# EAGLE schematic afridev_sensor (EAGLE 9.6.2)
Rev. 2 with MAX32660 microcontroller
AUTHOR: Juan Luna; BOARD_NAME: Afridev Hand Pump Sensor; COURSE: ENGR 460; DOC_NUM: 1; PROJECT_NAME: Working Well Senior Project; REVISION: 2
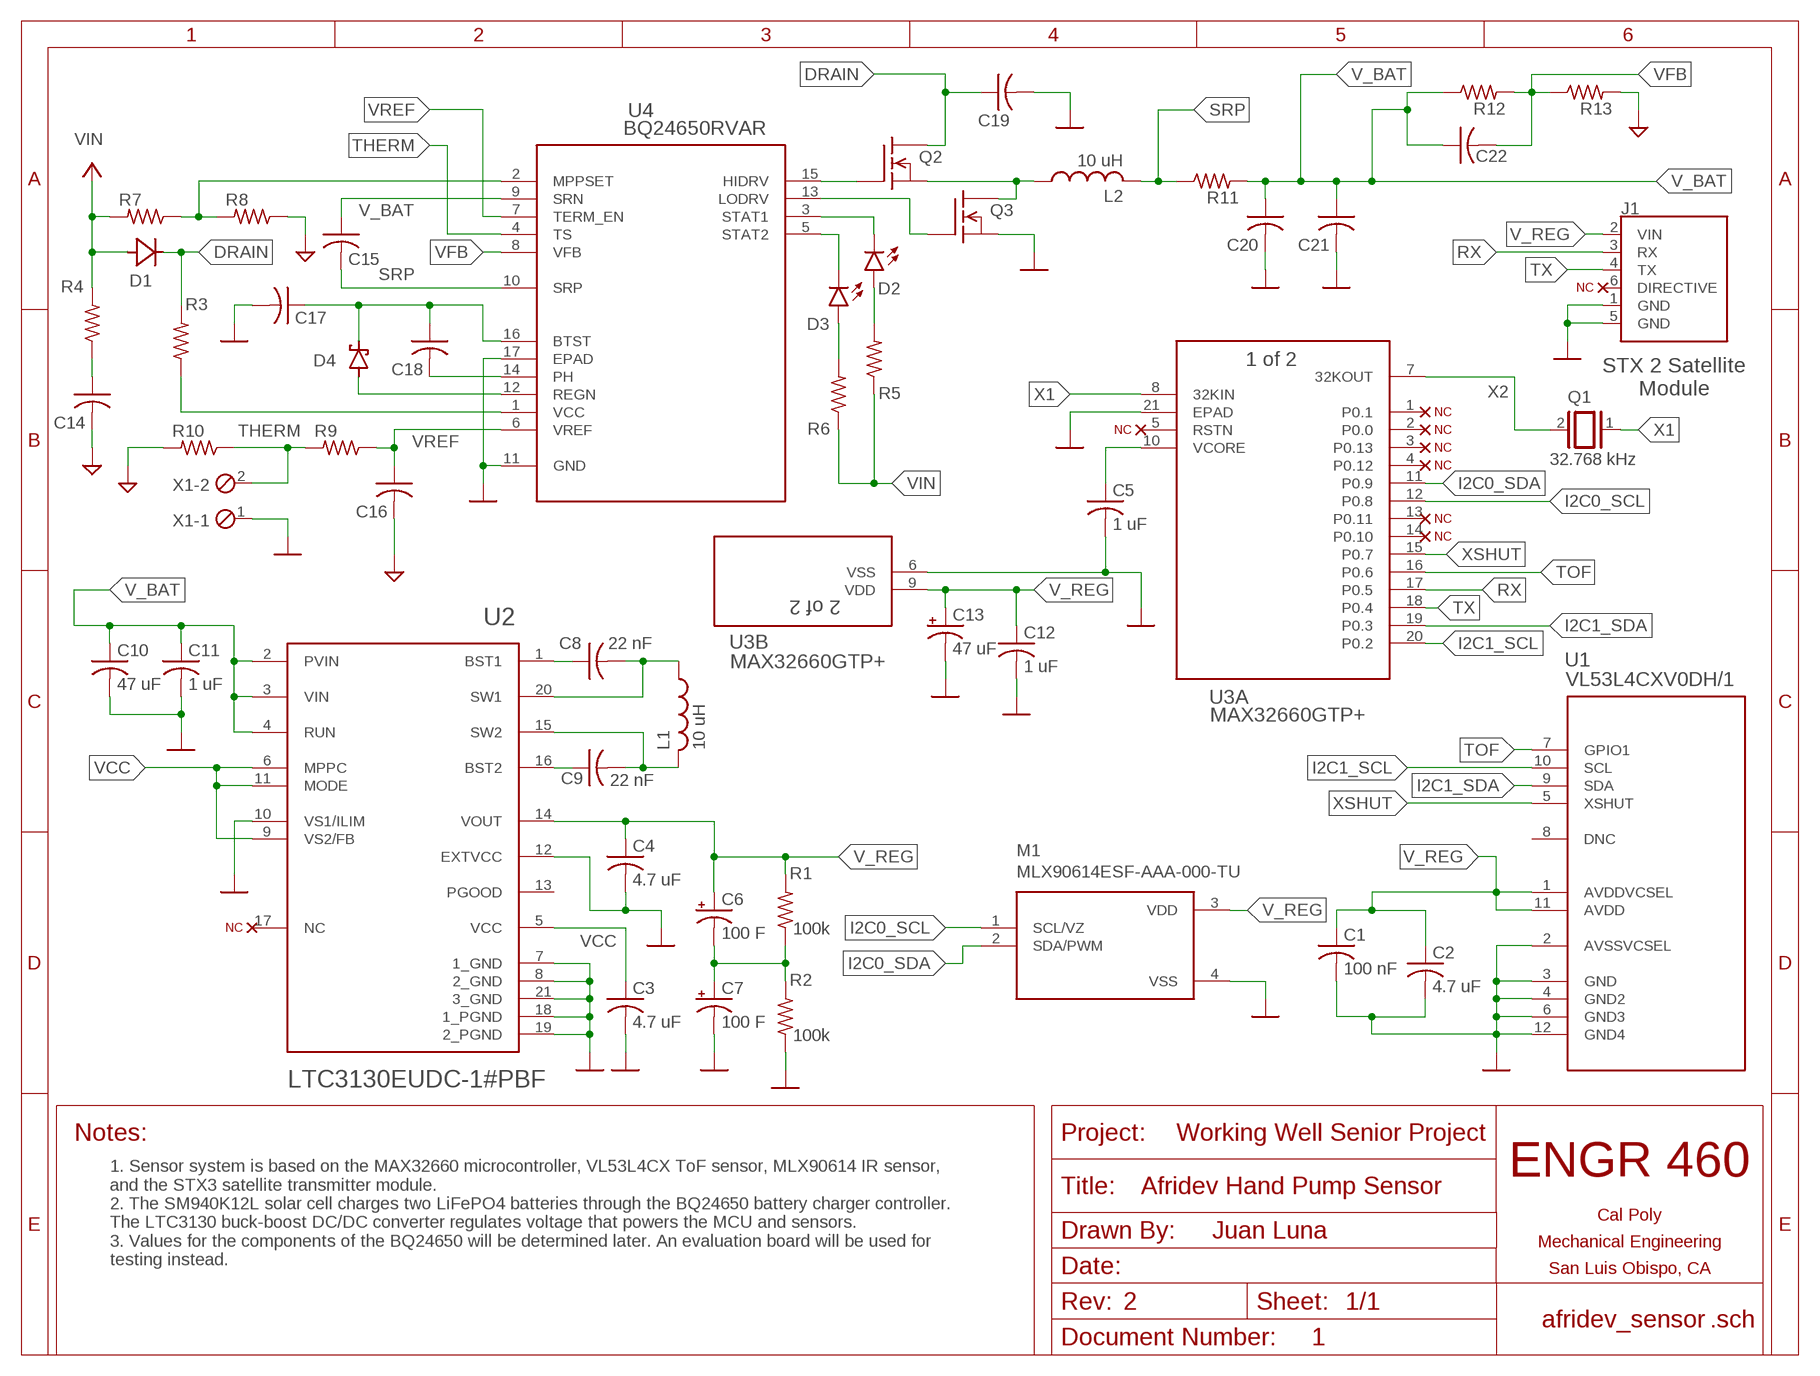
[diagram p0: schematic, sheet 1]

## Parts
C1  100 nF  C-US025-024X044  [C025-024X044]
C2  4.7 uF  C-US025-024X044  [C025-024X044]
C3  4.7 uF  C-US025-024X044  [C025-024X044]
C4  4.7 uF  C-US025-024X044  [C025-024X044]
C5  1 uF  C-US025-024X044  [C025-024X044]
C6  100 F  1000UF-RADIAL-5MM-25V-20%  [CPOL-RADIAL-5MM-10MM]
C7  100 F  1000UF-RADIAL-5MM-25V-20%  [CPOL-RADIAL-5MM-10MM]
C8  22 nF  C-US025-024X044  [C025-024X044]
C9  22 nF  C-US025-024X044  [C025-024X044]
C10  47 uF  C-US025-024X044  [C025-024X044]
C11  1 uF  C-US025-024X044  [C025-024X044]
C12  1 uF  C-US025-024X044  [C025-024X044]
C13  47 uF  1000UF-RADIAL-5MM-25V-20%  [CPOL-RADIAL-5MM-10MM]
C14  C-US025-024X044  [C025-024X044]
C15  C-US025-024X044  [C025-024X044]
C16  C-US025-024X044  [C025-024X044]
C17  C-US025-024X044  [C025-024X044]
C18  C-US025-024X044  [C025-024X044]
C19  1 uF  C-US025-024X044  [C025-024X044]
C20  1 uF  C-US025-024X044  [C025-024X044]
C21  1 uF  C-US025-024X044  [C025-024X044]
C22  1 uF  C-US025-024X044  [C025-024X044]
D1  DIODE  [DIODE-FOOT]
D2  LED  [LED-FOOT]
D3  LED  [LED-FOOT]
D4  BAS40  [SOT23]
J1  EM-506-VERTICAL  [JST-6PIN-1MM]
L1  10 uH  L-US0204/5  [0204/5]
L2  10 uH  L-US0204/5  [0204/5]
M1  MLX90614ESF-AAA-000-TU  [TO254P942H425-4]
Q1  32.768 kHz  XTAL/S  [QS]
Q2  BUZ10  [TO220]
Q3  BUZ10  [TO220]
R1  100k  R-US_R0805  [R0805]
R2  100k  R-US_R0805  [R0805]
R3  R-US_R0805  [R0805]
R4  R-US_R0805  [R0805]
R5  R-US_R0805  [R0805]
R6  R-US_R0805  [R0805]
R7  R-US_R0805  [R0805]
R8  R-US_R0805  [R0805]
R9  R-US_R0805  [R0805]
R10  R-US_R0805  [R0805]
R11  R-US_R0805  [R0805]
R12  R-US_R0805  [R0805]
R13  R-US_R0805  [R0805]
U1  VL53L4CXV0DH/1  [LGA12_STM]
U2  ANALOG_DEVICES_LTC3130EUDC-1#PBFANALOG_DEVICES_LTC3130EUDC-1#PBF_0_0  [ANALOG_DEVICES_LTC3130EUDC-1#PBF_0]
U3  MAX32660GTP+  [21-0139V_T2044+5_MXM]
U4  BQ24650RVAR  [RVA16_2P14X2P14]
U$1  NC  (no package)
U$2  NC  (no package)
U$3  NC  (no package)
U$4  NC  (no package)
U$5  NC  (no package)
U$6  NC  (no package)
U$7  NC  (no package)
U$8  NC  (no package)
U$9  NC  (no package)
X1  SCREWTERM_2P_254  [2POL254]

## Nets
AGND: C14.2 C16.2 R8.1 R10.2 R13.2
DGND: C1.2 C2.2 C3.2 C4.2 C5.2 C7.- C10.2 C11.2 C12.2 C13.- C17.2 C19.2 C20.2 C21.2 J1.1(GND) J1.5(GND) M1.4(VSS) Q3.3(S) R2.1 U1.2(AVSSVCSEL) U1.3(GND) U1.4(GND2) U1.6(GND3) U1.12(GND4) U2.7(1_GND) U2.8(2_GND) U2.10(VS1/ILIM) U2.12(EXTVCC) U2.18(1_PGND) U2.19(2_PGND) U2.21(3_GND) U3.6(B:VSS) U3.21(A:EPAD) U4.11(GND) U4.17(EPAD) X1.1
DRAIN: C19.1 D1.C Q2.2(D) R3.2
I2C0_SCL: M1.1(SCL/VZ) U3.12(A:P0.8)
I2C0_SDA: M1.2(SDA/PWM) U3.11(A:P0.9)
I2C1_SCL: U1.10(SCL) U3.20(A:P0.2)
I2C1_SDA: U1.9(SDA) U3.19(A:P0.3)
N$2: C5.1 U3.10(A:VCORE)
N$3: J1.6(DIRECTIVE) U$1.D
N$4: L2.1 Q2.3(S) Q3.2(D)
N$5: R3.1 U4.1(VCC)
N$6: C14.1 R4.1
N$7: U2.17(NC) U$2.D
N$8: C6.- C7.+ R1.1 R2.2
N$9: U3.5(A:RSTN) U$3.D
N$10: C8.1 U2.1(BST1)
N$11: C9.1 U2.16(BST2)
N$12: C8.2 L1.1 U2.20(SW1)
N$13: C9.2 L1.2 U2.15(SW2)
N$14: U3.1(A:P0.1) U$4.D
N$15: U3.2(A:P0.0) U$5.D
N$16: U3.3(A:P0.13) U$6.D
N$17: U3.4(A:P0.12) U$7.D
N$18: U3.13(A:P0.11) U$8.D
N$20: U3.14(A:P0.10) U$9.D
N$21: D2.C U4.3(STAT1)
N$22: D3.C U4.5(STAT2)
N$23: D2.A R5.2
N$24: D3.A R6.2
N$25: D4.1(A) U4.12(REGN)
N$26: R7.1 R8.2 U4.2(MPPSET)
N$28: C17.1 C18.1 D4.3(C) U4.16(BTST)
N$29: C18.2 U4.14(PH)
N$30: Q2.1(G) U4.15(HIDRV)
N$31: Q3.1(G) U4.13(LODRV)
RX: J1.3(RX) U3.17(A:P0.5)
SRP: C15.2 L2.2 R11.1 U4.10(SRP)
THERM: R9.2 R10.1 U4.4(TS) X1.2
TOF: U1.7(GPIO1) U3.16(A:P0.6)
TX: J1.4(TX) U3.18(A:P0.4)
V_BAT: C10.1 C11.1 C15.1 C20.1 C21.1 C22.1 R11.2 R12.1 U2.2(PVIN) U2.3(VIN) U2.4(RUN) U4.9(SRN)
V_REG: C1.1 C2.1 C4.1 C6.+ C12.1 C13.+ J1.2(VIN) M1.3(VDD) R1.2 U1.1(AVDDVCSEL) U1.11(AVDD) U2.14(VOUT) U3.9(B:VDD)
VCC: C3.1 U2.5(VCC) U2.6(MPPC) U2.9(VS2/FB) U2.11(MODE)
VFB: C22.2 R12.2 R13.1 U4.8(VFB)
VIN: D1.A R4.2 R5.1 R6.1 R7.2 ; supply symbol labelled AVCC
VREF: C16.1 R9.1 U4.6(VREF) U4.7(TERM_EN)
X1: Q1.1 U3.8(A:32KIN)
X2: Q1.2 U3.7(A:32KOUT)
XSHUT: U1.5(XSHUT) U3.15(A:P0.7)
Unconnected: U1.8(DNC) U2.13(PGOOD)

## Notes on the sheet
- STX 2 Satellite
  Module
- 1. Sensor system is based on the MAX32660 microcontroller, VL53L4CX ToF sensor, MLX90614 IR sensor, 
  and the STX3 satellite transmitter module.
  2. The SM940K12L solar cell charges two LiFePO4 batteries through the BQ24650 battery charger controller.
  The LTC3130 buck-boost DC/DC converter regulates voltage that powers the MCU and sensors.
  3. Values for the components of the BQ24650 will be determined later. An evaluation board will be used for
  testing instead.

## Library data of the parts
C1-C5 C8-C12 C14-C22 = resistor:C-US: CAPACITOR, American symbol
C6 C7 C13 = SparkFun-Capacitors:1000UF: 1,000µF/1mF ceramic capacitors A capacitor is a passive two-terminal electrical component used to store electrical energy temporarily in an electric field. CAP-08070; PROD_ID: CAP-09538; VALUE: 1mF
D1 = LUNA:DIODE
D2 D3 = LUNA:LED
D4 = diode:BAS40: Silicon Schottky Diodes General-purpose diode for high-speed switching
J1 = SparkFun-GPS:EM-506: USGlobalSat EM-506 High Performance GPS Module EM-506 GPS module features high sensitivity, low power and ultra small form factor. This GPS module is powered by SiRF Star IV, it can provide you with superior sensitivity and performance even in urban canyon and dense foliage environment. With SiRF CGEE (Client Generated Extended Ephemeris) technology, it predicts satellite positions for up to 3 days and delivers CGEE-start time of less than 15 seconds under most conditions, without any network assistance. Besides, MicroPower Mode allows GPS module to stay in a hot-start condition nearly continuously while consuming very little power. SparkFun Products GPS Receiver - EM-506 (48 Channel) <https://www.sparkfun.com/products/12751> (GPS-12751); PROD_ID: CONN-08249
L1 L2 = resistor:L-US: INDUCTOR, American symbol
M1 = MLX90614ESF:MLX90614ESF-AAA-000-TU: Temperature Sensor Digital, Infrared (IR) -40°C ~ 85°C 16 b TO-39 Check availability <https://pricing.snapeda.com/parts/MLX90614ESF-AAA-000-TU/Melexis/view-part?ref=eda>; AVAILABILITY: In Stock; DESCRIPTION: Temperature Sensor Digital, Infrared (IR) -40°C ~ 85°C 16 b TO-39; MF: Melexis; MP: MLX90614ESF-AAA-000-TU; PACKAGE: TO-39 Melexis; PRICE: None; PURCHASE-URL: https://pricing.snapeda.com/search/part/MLX90614ESF-AAA-000-TU/?ref=eda
Q1 = special:XTAL/S: CRYSTAL
Q2 Q3 = transistor-fet:BUZ10: N-Channel Enhancement MOSFET 50V; 20A; 0,080Ohm
R1-R13 = resistor:R-US_: RESISTOR, American symbol
U1 = VL53L4CXV0DH:VL53L4CXV0DH/1; COPYRIGHT: Copyright (C) 2023 Ultra Librarian. All rights reserved.; MANUFACTURER_PART_NUMBER: VL53L4CXV0DH/1; MFR_NAME: STMicroelectronics
U2 = LTC3130EUDC:ANALOG_DEVICES_LTC3130EUDC-1#PBF: Buck-Boost Switching Regulator IC Positive Programmable 1.8V, 3.3V, 5V, 12V 1 Output 600mA 20-WFQFN Exposed Pad; AUTOMOTIVE: No; CENTROID_NOT_SPECIFIED: No; DATASHEET: https://www.analog.com/media/en/technical-documentation/data-sheets/3130f.pdf; DEVICE_CLASS_L1: Integrated Circuits (ICs); DEVICE_CLASS_L2: Power Management ICs; DEVICE_CLASS_L3: Voltage Regulators - Switching; DIGIKEY_DESCRIPTION: IC REG BCK BST PROG 600MA 20QFN; DIGIKEY_PART_NUMBER: LTC3130EUDC-1#PBF-ND; FOOTPRINT_PARAMETERS_1: {"fp_type":"QFN","params":{"N1":{"nom":6,"long name":"Leads on long side","min":null,"max":null,"short name":"N1","type":"count"},"N2":{"nom":4,"long name":"Leads on wide side","min":null,"max":null,"short name":"N2","type":"count"},"A":{"nom":750000,"long name":"Height","min":700000,"max":800000,"short name":"A","type":"measurement"},"A1":{"nom":false,"long name":"Package clearance","min":0,"max":50000,"short name":"A1","type":"measurement"},"A2":{"nom":725000,"long name":"Package height","min":650000,"max":800000,"short name":"A2","type":"measurement"},"D":{"nom":4000000,"long name":"Package length","min":3900000,"max":4099999,"short name":"D","type":"measurement"},"E":{"nom":3000000,"long name":"Package width","min":2900000,"max":3100000,"short name":"E","type":"measurement"},"B":{"nom":250000,"long name":"Lead width","min":200000,"max":300000,"short name":"B","type":"measurement"},"C":{"nom":200000,"long name":"Lead thickness","min":null,"max":null,"short name":"C","type":"measurement"},"L":{"nom":400000,"long name":"Lead foot length","min":300000,"max":500000,"short name":"L","type":"measurement"},"e":{"nom":500000,"long name":"Lead pitch","min":null,"max":null,"short name":"e","type":"measurement"},"D2":{"nom":2650000,"long name":"Thermal pad length","min":2550000,"max":2750000,"short name":"D2","type":"measurement"},"E2":{"nom":1650000,"long name":"Thermal pad width","min":1550000,"max":1750000,"short name":"E2","type":"measurement"},"PC":{"long name":"Paste coverage (%)","type":"percentage","short name":"PC","value":40},"HT":{"default":"Yes","long name":"Thermal pad","type":"multichoiceparent","short name":"HT","children":["D2","E2","PC"]},"offset x":{"nom":0,"long name":"X Center offset","min":null,"max":null,"short name":"offset x","type":"measurement"},"offset y":{"nom":0,"long name":"Y Center offset","min":null,"max":null,"short name":"offset y","type":"measurement"},"LS":{"default":"Rounded rectangle","long name":"Land shape","type":"multichoice","short name":"LS"},"LS1":{"default":"Rectangle","long name":"Land shape (Pin 1)","type":"multichoice","short name":"LS1"},"solder toe":{"nom":400000,"long name":"Solder fillet (toe)","min":null,"max":null,"short name":"solder toe","type":"fixedmeasurement"},"solder heel":{"nom":0,"long name":"Solder fillet (heel)","min":null,"max":null,"short name":"solder heel","type":"fixedmeasurement"},"solder side":{"nom":-40000,"long name":"Solder fillet (side)","min":null,"max":null,"short name":"solder side","type":"fixedmeasurement"},"courtyard":{"nom":500000,"long name":"Courtyard","min":null,"max":null,"short name":"courtyard","type":"fixedmeasurement"},"SF":{"default":"A","long name":"Packing level","type":"multichoiceparent","short name":"SF","help":"http://support.upverter.com/customer/portal/articles/978783-what-is-a-footprint-packing-level","children":["solder toe","solder heel","solder side","courtyard"]}}}; FOOTPRINT_PARAMETERS_2: {"fp_type":"QFN","params":{"N1":{"nom":6,"long name":"Leads on long side","min":null,"max":null,"short name":"N1","type":"count"},"N2":{"nom":4,"long name":"Leads on wide side","min":null,"max":null,"short name":"N2","type":"count"},"A":{"nom":750000,"long name":"Height","min":700000,"max":800000,"short name":"A","type":"measurement"},"A1":{"nom":false,"long name":"Package clearance","min":0,"max":50000,"short name":"A1","type":"measurement"},"A2":{"nom":725000,"long name":"Package height","min":650000,"max":800000,"short name":"A2","type":"measurement"},"D":{"nom":4000000,"long name":"Package length","min":3900000,"max":4099999,"short name":"D","type":"measurement"},"E":{"nom":3000000,"long name":"Package width","min":2900000,"max":3100000,"short name":"E","type":"measurement"},"B":{"nom":250000,"long name":"Lead width","min":200000,"max":300000,"short name":"B","type":"measurement"},"C":{"nom":200000,"long name":"Lead thickness","min":null,"max":null,"short name":"C","type":"measurement"},"L":{"nom":400000,"long name":"Lead foot length","min":300000,"max":500000,"short name":"L","type":"measurement"},"e":{"nom":500000,"long name":"Lead pitch","min":null,"max":null,"short name":"e","type":"measurement"},"D2":{"nom":2650000,"long name":"Thermal pad length","min":2550000,"max":2750000,"short name":"D2","type":"measurement"},"E2":{"nom":1650000,"long name":"Thermal pad width","min":1550000,"max":1750000,"short name":"E2","type":"measurement"},"PC":{"long name":"Paste coverage (%)","type":"percentage","short name":"PC","value":40},"HT":{"default":"Yes","long name":"Thermal pad","type":"multichoiceparent","short name":"HT","children":["D2","E2","PC"]},"offset x":{"nom":0,"long name":"X Center offset","min":null,"max":null,"short name":"offset x","type":"measurement"},"offset y":{"nom":0,"long name":"Y Center offset","min":null,"max":null,"short name":"offset y","type":"measurement"},"LS":{"default":"Rounded rectangle","long name":"Land shape","type":"multichoice","short name":"LS"},"LS1":{"default":"Rectangle","long name":"Land shape (Pin 1)","type":"multichoice","short name":"LS1"},"solder toe":{"nom":300000,"long name":"Solder fillet (toe)","min":null,"max":null,"short name":"solder toe","type":"fixedmeasurement"},"solder heel":{"nom":0,"long name":"Solder fillet (heel)","min":null,"max":null,"short name":"solder heel","type":"fixedmeasurement"},"solder side":{"nom":-40000,"long name":"Solder fillet (side)","min":null,"max":null,"short name":"solder side","type":"fixedmeasurement"},"courtyard":{"nom":250000,"long name":"Courtyard","min":null,"max":null,"short name":"courtyard","type":"fixedmeasurement"},"SF":{"default":"B","long name":"Packing level","type":"multichoiceparent","short name":"SF","help":"http://support.upverter.com/customer/portal/articles/978783-what-is-a-footprint-packing-level","children":["solder toe","solder heel","solder side","courtyard"]}}}; FOOTPRINT_PARAMETERS_3: {"fp_type":"QFN","params":{"N1":{"nom":6,"long name":"Leads on long side","min":null,"max":null,"short name":"N1","type":"count"},"N2":{"nom":4,"long name":"Leads on wide side","min":null,"max":null,"short name":"N2","type":"count"},"A":{"nom":750000,"long name":"Height","min":700000,"max":800000,"short name":"A","type":"measurement"},"A1":{"nom":false,"long name":"Package clearance","min":0,"max":50000,"short name":"A1","type":"measurement"},"A2":{"nom":725000,"long name":"Package height","min":650000,"max":800000,"short name":"A2","type":"measurement"},"D":{"nom":4000000,"long name":"Package length","min":3900000,"max":4099999,"short name":"D","type":"measurement"},"E":{"nom":3000000,"long name":"Package width","min":2900000,"max":3100000,"short name":"E","type":"measurement"},"B":{"nom":250000,"long name":"Lead width","min":200000,"max":300000,"short name":"B","type":"measurement"},"C":{"nom":200000,"long name":"Lead thickness","min":null,"max":null,"short name":"C","type":"measurement"},"L":{"nom":400000,"long name":"Lead foot length","min":300000,"max":500000,"short name":"L","type":"measurement"},"e":{"nom":500000,"long name":"Lead pitch","min":null,"max":null,"short name":"e","type":"measurement"},"D2":{"nom":2650000,"long name":"Thermal pad length","min":2550000,"max":2750000,"short name":"D2","type":"measurement"},"E2":{"nom":1650000,"long name":"Thermal pad width","min":1550000,"max":1750000,"short name":"E2","type":"measurement"},"PC":{"long name":"Paste coverage (%)","type":"percentage","short name":"PC","value":40},"HT":{"default":"Yes","long name":"Thermal pad","type":"multichoiceparent","short name":"HT","children":["D2","E2","PC"]},"offset x":{"nom":0,"long name":"X Center offset","min":null,"max":null,"short name":"offset x","type":"measurement"},"offset y":{"nom":0,"long name":"Y Center offset","min":null,"max":null,"short name":"offset y","type":"measurement"},"LS":{"default":"Rounded rectangle","long name":"Land shape","type":"multichoice","short name":"LS"},"LS1":{"default":"Rectangle","long name":"Land shape (Pin 1)","type":"multichoice","short name":"LS1"},"solder toe":{"nom":200000,"long name":"Solder fillet (toe)","min":null,"max":null,"short name":"solder toe","type":"fixedmeasurement"},"solder heel":{"nom":0,"long name":"Solder fillet (heel)","min":null,"max":null,"short name":"solder heel","type":"fixedmeasurement"},"solder side":{"nom":-40000,"long name":"Solder fillet (side)","min":null,"max":null,"short name":"solder side","type":"fixedmeasurement"},"courtyard":{"nom":100000,"long name":"Courtyard","min":null,"max":null,"short name":"courtyard","type":"fixedmeasurement"},"SF":{"default":"C","long name":"Packing level","type":"multichoiceparent","short name":"SF","help":"http://support.upverter.com/customer/portal/articles/978783-what-is-a-footprint-packing-level","children":["solder toe","solder heel","solder side","courtyard"]}}}; FOOTPRINT_URL: https://www.analog.com/media/en/package-pcb-resources/package/pkg_pdf/ltc-legacy-qfn/QFN_20_05-08-1742.pdf; FOOTPRINT_VARIANT_NAME_0: Recommended_Land_Pattern; FOOTPRINT_VARIANT_NAME_1: IPC_A; FOOTPRINT_VARIANT_NAME_2: IPC_B; FOOTPRINT_VARIANT_NAME_3: IPC_C; HEIGHT: 0.8mm; IPC_LAND_PATTERN_NAME: QFN50P300X400X75-20; LEAD_FREE: Yes; MAX_DUTY_CYCLE: 97%; MAX_JUNCTION_TEMP: +125°C; MAX_SUPPLY_VOLTAGE: 25V; MF: Analog Devices; MFG_PACKAGE_IDENT: UDC-20-05-08-1742; MFG_PACKAGE_IDENT_COMPONENT_ID: 1e5b9b074e7db5b1; MFG_PACKAGE_IDENT_DATE: 0; MFG_PACKAGE_IDENT_REV: Ø; MIN_SUPPLY_VOLTAGE: 2.4V; MOUSER_DESCRIPTION: LTC3130 - 25V, 600mA Buck-Boost DC/DC Converter with 1.6µA Quiescent Current; MOUSER_PART_NUMBER: 584-LTC3130EUDC-1PBF; MPN: LTC3130EUDC-1#PBF; NOMINAL_SUPPLY_CURRENT: 1.6uA; NUMBER_OF_OUTPUTS: 1; OUTPUT_CURRENT: 600mA; OUTPUT_TYPE: AdjustableProgrammable; OUTPUT_VOLTAGE: 1.8-12V; PACKAGE: QFN20; PREFIX: U; ROHS: Yes; STANDOFF_HEIGHT: 0mm; SWITCHING_FREQUENCY: 1.2MHz; SWITCHING_TOPOLOGY: Buck-Boost; TEMPERATURE_RANGE_HIGH: +125°C; TEMPERATURE_RANGE_LOW: -40°C; VERIFICATION_VERSION: 0.0.0.3
U3 = MAX32660GTP:MAX32660GTP+; COPYRIGHT: Copyright (C) 2023 Ultra Librarian. All rights reserved.; MANUFACTURER_PART_NUMBER: MAX32660GTP+; MFR_NAME: Analog Devices Inc
U4 = BQ24650RVAR:BQ24650RVAR; COPYRIGHT: Copyright (C) 2023 Ultra Librarian. All rights reserved.; DIGI-KEY_PART_NUMBER_1: 2156-BQ24650RVAR-ND; DIGI-KEY_PART_NUMBER_2: 296-46287-1-ND; DIGI-KEY_PART_NUMBER_3: 296-46287-2-ND; DIGI-KEY_PART_NUMBER_4: 296-46287-6-ND; DIGI-KEY_PART_NUMBER_5: BQ24650RVAR-ND; MANUFACTURER_PART_NUMBER: BQ24650RVAR; MFR_NAME: Texas Instruments
U$1-U$9 = ME507:NC
X1 = ME507:SCREWTERM_2P: Screw Terminal Block This part is designed for a screw terminal connector. The 2.54mm (0.100 inch) foorprint can also be used for male or female pin headers such as those on most development boards. One can also solder wires directly into the holes, though this makes modifications or repairs to the system more inconvenient. Larger versions can carry more current.